# EAGLE design WaterMonitorV6.0 (EAGLE 7.4.0)
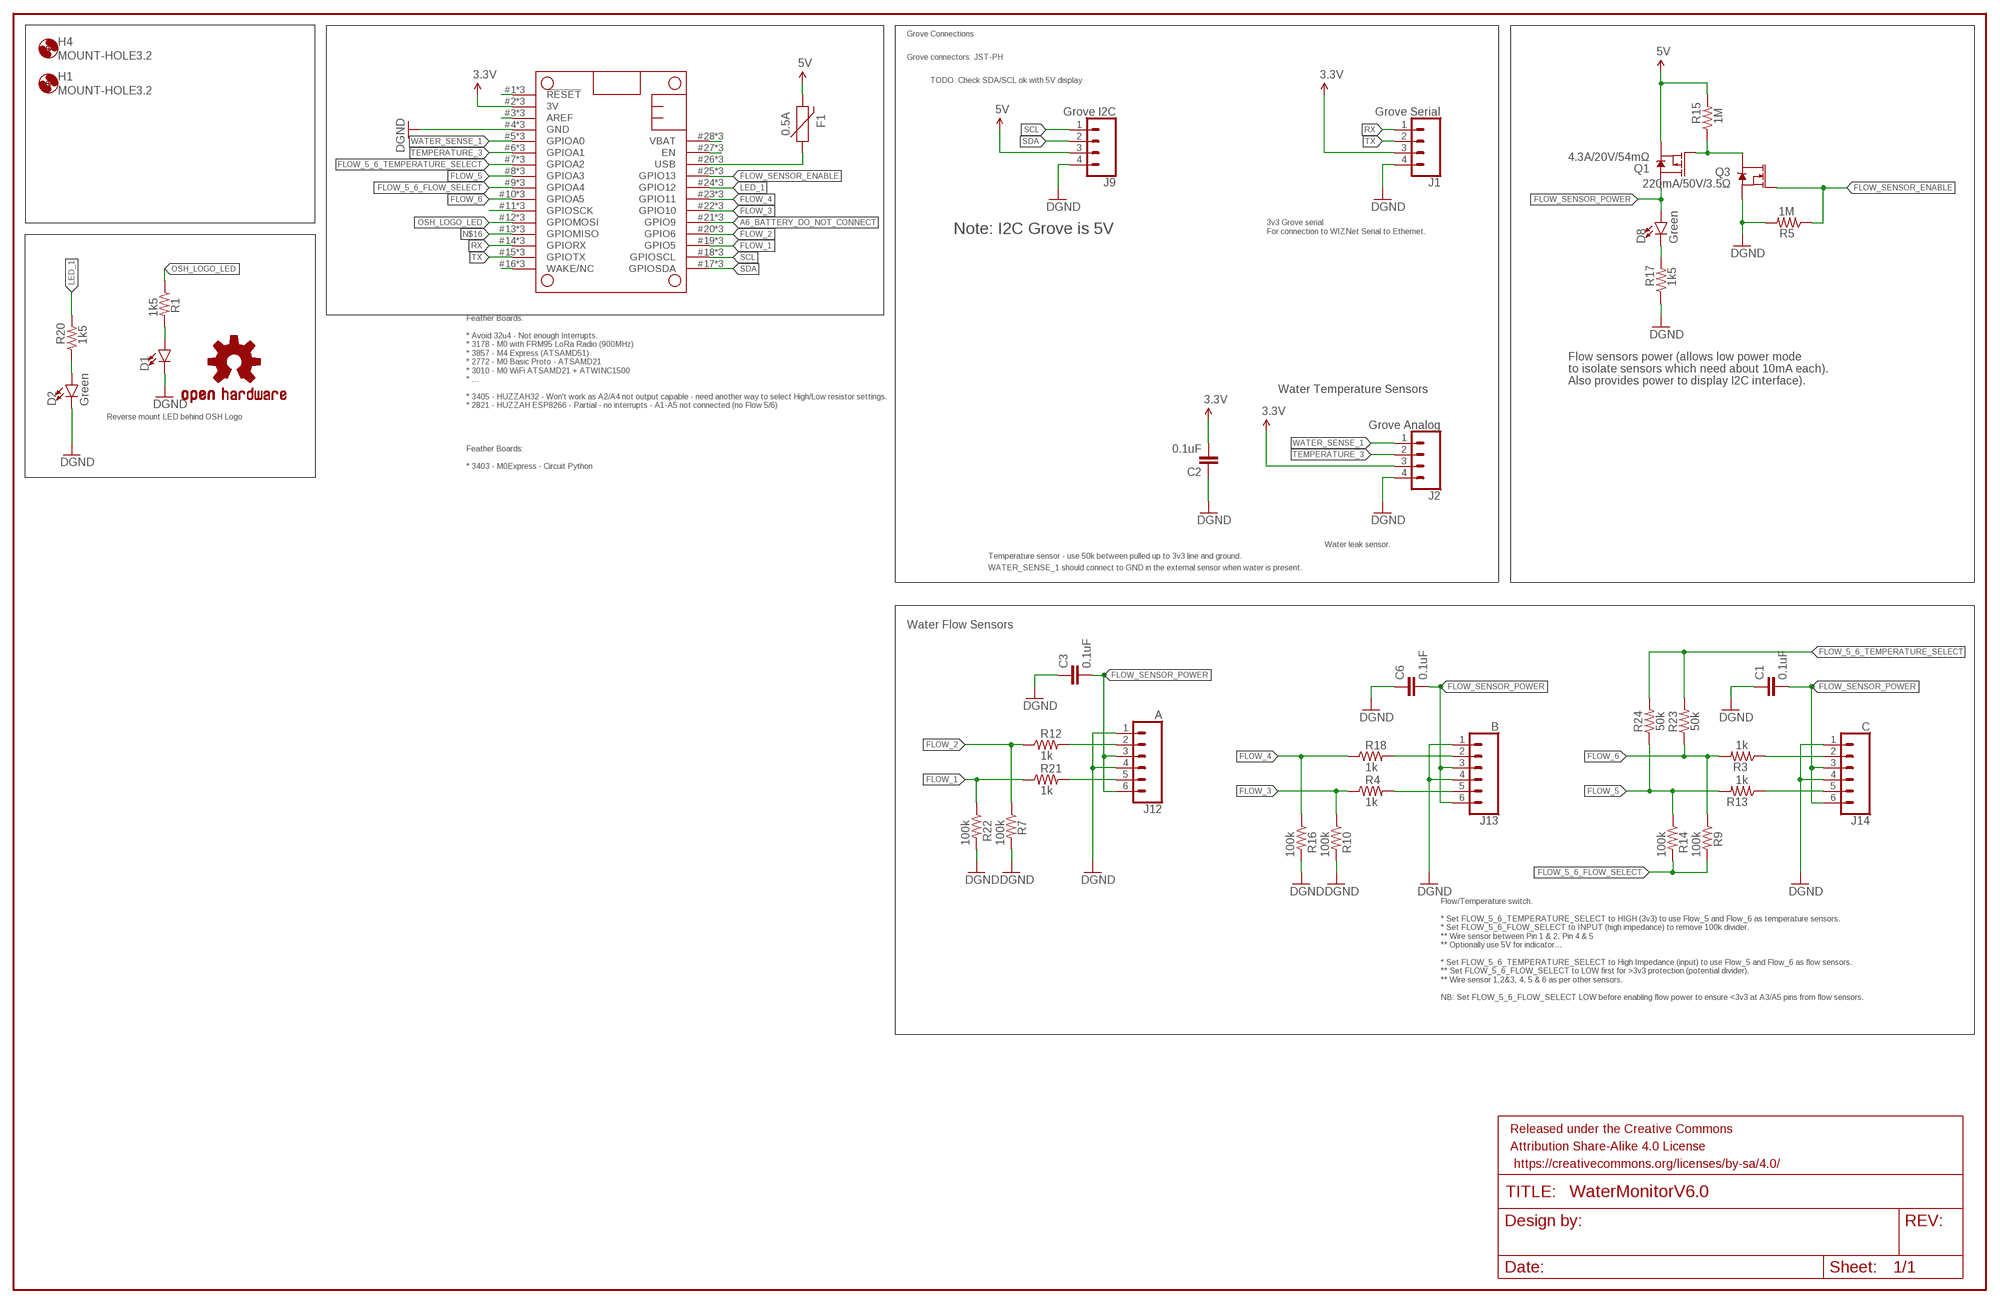
[diagram p0: schematic, sheet 1]

## Parts
C1  0.1uF  CAP0805  [0805]
C2  0.1uF  CAP0805  [0805]
C3  0.1uF  CAP0805  [0805]
C6  0.1uF  CAP0805  [0805]
D1  LED1206-BOTTOM  [LED-1206-BOTTOM]
D2  Green  LED-BLUE1206  [LED-1206]
D8  Green  LED-BLUE1206  [LED-1206]
F1  0.5A  PPTC_HALF-AMP  [1206]
FRAME2  FRAME-LEDGER  [CREATIVE_COMMONS]
H1  MOUNT-HOLE3.2  [3,2]
H4  MOUNT-HOLE3.2  [3,2]
J1  Grove Serial  CONN_04JST-PTH-VERT  [JST-4-PTH-VERT]
J2  Grove Analog  CONN_04JST-PTH-VERT  [JST-4-PTH-VERT]
J9  Grove I2C  CONN_04JST-PTH-VERT  [JST-4-PTH-VERT]
J12  A  RJ11-6  [RJ11-6]
J13  B  RJ11-6  [RJ11-6]
J14  C  RJ11-6  [RJ11-6]
LOGO1  OSHW-LOGOM  [OSHW-LOGO-M]
MS1  FEATHERWINGFEATHEWING_BREAKOUT  [FEATHERWING_BREAKOUT]
Q1  4.3A/20V/54mΩ  MOSFET_PCH-IRLML2244  [SOT23-3]
Q3  220mA/50V/3.5Ω  MOSFET-NCH-BSS138  [SOT23-3]
R1  1k5  RESISTOR0805  [0805]
R3  1k  RESISTOR0805  [0805]
R4  1k  RESISTOR0805  [0805]
R5  1M  RESISTOR0805  [0805]
R7  100k  RESISTOR0805  [0805]
R9  100k  RESISTOR0805  [0805]
R10  100k  RESISTOR0805  [0805]
R12  1k  RESISTOR0805  [0805]
R13  1k  RESISTOR0805  [0805]
R14  100k  RESISTOR0805  [0805]
R15  1M  RESISTOR0805  [0805]
R16  100k  RESISTOR0805  [0805]
R17  1k5  RESISTOR0805  [0805]
R18  1k  RESISTOR0805  [0805]
R20  1k5  RESISTOR0805  [0805]
R21  1k  RESISTOR0805  [0805]
R22  100k  RESISTOR0805  [0805]
R23  50k  RESISTOR0805  [0805]
R24  50k  RESISTOR0805  [0805]

## Nets
3.3V: C2.2 J1.3 J2.3 MS1.2(3V) MS1.#2(3V) MS1.@2(3V)
5V: F1.2 J9.3 Q1.2(S) R15.2
A6_BATTERY_DO_NOT_CONNECT: MS1.21(GPIO9) MS1.#21(GPIO9) MS1.@21(GPIO9)
FLOW_1: MS1.19(GPIO5) MS1.#19(GPIO5) MS1.@19(GPIO5) R21.1 R22.1
FLOW_2: MS1.20(GPIO6) MS1.#20(GPIO6) MS1.@20(GPIO6) R7.1 R12.1
FLOW_3: MS1.22(GPIO10) MS1.#22(GPIO10) MS1.@22(GPIO10) R4.1 R10.1
FLOW_4: MS1.23(GPIO11) MS1.#23(GPIO11) MS1.@23(GPIO11) R16.1 R18.1
FLOW_5: MS1.8(GPIOA3) MS1.#8(GPIOA3) MS1.@8(GPIOA3) R13.2 R14.1 R24.1
FLOW_5_6_FLOW_SELECT: MS1.9(GPIOA4) MS1.#9(GPIOA4) MS1.@9(GPIOA4) R9.2 R14.2
FLOW_5_6_TEMPERATURE_SELECT: MS1.7(GPIOA2) MS1.#7(GPIOA2) MS1.@7(GPIOA2) R23.2 R24.2
FLOW_6: MS1.10(GPIOA5) MS1.#10(GPIOA5) MS1.@10(GPIOA5) R3.2 R9.1 R23.1
FLOW_SENSOR_ENABLE: MS1.25(GPIO13) MS1.#25(GPIO13) MS1.@25(GPIO13) Q3.1(G) R5.1
FLOW_SENSOR_POWER: C1.2 C3.2 C6.2 D8.A J12.3 J12.6 J13.3 J13.6 J14.3 J14.6 Q1.3(D)
GND: C1.1 C2.1 C3.1 C6.1 D1.C D2.C J1.4 J2.4 J9.4 J12.1 J12.4 J13.1 J13.4 J14.1 J14.4 MS1.4(GND) MS1.#4(GND) MS1.@4(GND) Q3.2(S) R5.2 R7.2 R10.2 R16.2 R17.1 R22.2 ; supply symbol labelled DGND
LED_1: MS1.24(GPIO12) MS1.#24(GPIO12) MS1.@24(GPIO12) R20.2
N$1: J12.5 R21.2
N$3: J14.2 R3.1
N$4: J13.5 R4.2
N$6: J14.5 R13.1
N$7: D8.C R17.2
N$11: D2.A R20.1
N$12: J12.2 R12.2
N$13: MS1.1(!RESET) MS1.#1(!RESET) MS1.@1(!RESET)
N$15: MS1.27(EN) MS1.#27(EN) MS1.@27(EN)
N$16: MS1.13(GPIOMISO) MS1.#13(GPIOMISO) MS1.@13(GPIOMISO)
N$19: Q1.1(G) Q3.3(D) R15.1
N$20: MS1.3(AREF) MS1.#3(AREF) MS1.@3(AREF)
N$21: D1.A R1.2
N$22: J13.2 R18.2
N$25: MS1.11(GPIOSCK) MS1.#11(GPIOSCK) MS1.@11(GPIOSCK)
N$47: MS1.16(WAKE/NC) MS1.#16(WAKE/NC) MS1.@16(WAKE/NC)
OSH_LOGO_LED: MS1.12(GPIOMOSI) MS1.#12(GPIOMOSI) MS1.@12(GPIOMOSI) R1.1
RX: J1.1 MS1.14(GPIORX) MS1.#14(GPIORX) MS1.@14(GPIORX)
SCL: J9.1 MS1.18(GPIOSCL) MS1.#18(GPIOSCL) MS1.@!8(GPIOSCL)
SDA: J9.2 MS1.17(GPIOSDA) MS1.#17(GPIOSDA) MS1.@17(GPIOSDA)
TEMPERATURE_3: J2.2 MS1.6(GPIOA1) MS1.#6(GPIOA1) MS1.@6(GPIOA1)
TX: J1.2 MS1.15(GPIOTX) MS1.#15(GPIOTX) MS1.@15(GPIOTX)
USB: F1.1 MS1.26(USB) MS1.#26(USB) MS1.@26(USB)
VBAT: MS1.28(VBAT) MS1.#28(VBAT) MS1.@28(VBAT)
WATER_SENSE_1: J2.1 MS1.5(GPIOA0) MS1.#5(GPIOA0) MS1.@5(GPIOA0)

## Notes on the sheet
- Grove Connections
- Grove connectors: JST-PH
- TODO: Check SDA/SCL ok with 5V display
- Note: I2C Grove is 5V
- 3v3 Grove serial 
  For connection to WIZNet Serial to Ethernet.
- Water Temperature Sensors
- Flow sensors power (allows low power mode 
  to isolate sensors which need about 10mA each).
  Also provides power to display I2C interface).
- Feather Boards:
  
  * Avoid 32u4 - Not enough Interrupts.
  * 3178 - M0 with FRM95 LoRa Radio (900MHz)
  * 3857 - M4 Express (ATSAMD51)
  * 2772 - M0 Basic Proto - ATSAMD21
  * 3010 - M0 WiFi ATSAMD21 + ATWINC1500
  * ...
  
  * 3405 - HUZZAH32 - Won't work as A2/A4 not output capable - need another way to select High/Low resistor settings.
  * 2821 - HUZZAH ESP8266 - Partial - no interrupts - A1-A5 not connected (no Flow 5/6)
- Reverse mount LED behind OSH Logo
- Feather Boards:
  
  * 3403 - M0Express - Circuit Python
- Water leak sensor.
- Temperature sensor - use 50k between pulled up to 3v3 line and ground.
- WATER_SENSE_1 should connect to GND in the external sensor when water is present.
- Water Flow Sensors
- Flow/Temperature switch.
  
  * Set FLOW_5_6_TEMPERATURE_SELECT to HIGH (3v3) to use Flow_5 and Flow_6 as temperature sensors.
  * Set FLOW_5_6_FLOW_SELECT to INPUT (high impedance) to remove 100k divider.
  ** Wire sensor between Pin 1 & 2, Pin 4 & 5
  ** Optionally use 5V for indicator...
  
  * Set FLOW_5_6_TEMPERATURE_SELECT to High Impedance (input) to use Flow_5 and Flow_6 as flow sensors.
  ** Set FLOW_5_6_FLOW_SELECT to LOW first for >3v3 protection (potential divider).
  ** Wire sensor 1,2&3, 4, 5 & 6 as per other sensors.
  
  NB: Set FLOW_5_6_FLOW_SELECT LOW before enabling flow power to ensure <3v3 at A3/A5 pins from flow sensors.

## Library data of the parts
C1-C3 C6 = SparkFun-Passives:CAP: Capacitor Standard 0603 ceramic capacitor, and 0.1" leaded capacitor.
D1 = SparkFun-LED:LED: LED (Generic) Standard schematic elements and footprints for 5mm, 3mm, 1206, and 0603 sized LEDs. Generic LEDs with no color specified.
D2 D8 = SparkFun-LED:LED-BLUE: Blue SMD LED Used in manufacturing of various products at SparkFun Packages: 0603 - SMD 0603 package [Product Link] <http://www.digikey.com/product-detail/en/SMLE12BC7TT86/511-1589-2-ND/1641808> 1206 - SMD1206 package [Product Link] <http://www.digikey.com/product-detail/en/lite-on-inc/LTST-C150TBKT/160-1643-1-ND/573584> SparkFun Products: ESP8266 Thing-Dev Board <https://www.sparkfun.com/products/13711> RedBoard <https://www.sparkfun.com/products/12757>; PROD_ID: DIO-09911; VALUE: BLUE
F1 = SparkFun-Fuses:PPTC: Resettable Fuse PPTC Resettable Fuse. Really a sort of resistor with a polymeric positive temperature coefficient whose resistance increases dramatically with an increase in temperature. When heated by the power passing through the resistance rises causing the current to be limited, protecting the circuit. This is achieved by the transition of the polymer from a crystalline to an amorphous state where the conductive carbon separates breaking the conductive pathways found in the cool crystalline structure. When a PPTC cools back down it resumes conducting letting the circuit turn back on. SparkFun Products: SparkFun RedBoard - Programmed with Arduino <https://www.sparkfun.com/products/12757> Pro Micro - 5V/16MHz <https://www.sparkfun.com/products/12640> Arduino Pro 328 - 5V/16MHz <https://www.sparkfun.com/products/10915> MP3 Trigger <https://www.sparkfun.com/products/13720>; PROD_ID: RES-08585; VALUE: 6V/0.5A
FRAME2 = SparkFun-Aesthetics:FRAME-LEDGER: Schematic Frame Standard 11x14 US Ledger frame
H1 H4 = holes:MOUNT-HOLE: MOUNTING HOLE with drill center marker
J1 J2 J9 = SparkFun-Connectors:CONN_04: Multi connection point. Often used as Generic Header-pin footprint for 0.1 inch spaced/style header connections On any of the 0.1 inch spaced packages, you can populate with these: Break Away Headers - Straight <https://www.sparkfun.com/products/116> (PRT-00116) Break Away Male Headers - Right Angle <https://www.sparkfun.com/products/553> (PRT-00553) Female Headers <https://www.sparkfun.com/products/115> (PRT-00115) Break Away Headers - Machine Pin <https://www.sparkfun.com/products/117> (PRT-00117) Break Away Female Headers - Swiss Machine Pin <https://www.sparkfun.com/products/743> (PRT-00743) For SCREWTERMINALS and SPRING TERMINALS visit here: Screw Terimnals on SparkFun.com <https://www.sparkfun.com/search/results?term=Screw+Terminals> (5mm/3.5mm/2.54mm spacing) This device is also useful as a general connection point to wire up your design to another part of your project. Our various solder wires solder well into these plated through hole pads. Hook-Up Wire - Assortment (Stranded, 22 AWG) <https://www.sparkfun.com/products/11375> (PRT-11375) Hook-Up Wire - Assortment (Solid Core, 22 AWG) <https://www.sparkfun.com/products/11367> (PRT-11367) View the entire wire category on our website here <https://www.sparkfun.com/categories/141> Special notes: Molex polarized connector foot print use with SKU : PRT-08231 with associated crimp pins and housings. 1MM SMD Version SKU: PRT-10208; PROD_ID: CONN-13251
J12-J14 = SparkFun-Connectors:RJ11-6: RJ11 Jack - 6 pin Commonly found on CAT3 devices and some Microchip programmers. Here is the connector we sell at SparkFun: RJ11 6-Pin Connector <https://www.sparkfun.com/products/132> (PRT-00132) Datasheet <http://www.sparkfun.com/datasheets/Prototyping/Connectors/RJ11-Datasheet.pdf> It is used on this SparkFun product: SparkFun Weather Shield <https://www.sparkfun.com/products/12081> (DEV-12081) Weather Meters <https://www.sparkfun.com/products/8942> (SEN-08942); PROD_ID: CONN-08590; SF_ID: PRT-00132; VALUE: RJ11
LOGO1 = SparkFun-Aesthetics:OSHW-LOGO: Open Source Hardware Logo This logo indicates the piece of hardware it is found on incorporates a OSHW license and/or adheres to the definition of open source hardware found here: http://freedomdefined.org/OSHW
MS1 = ThingySticks:FEATHERWING
Q1 = SparkFun-DiscreteSemi:MOSFET_PCH: P-channel MOSFETs Voltage controlled devices that allow control of high current outputs. SparkFun Products: SparkFun ESP32 Thing <https://www.sparkfun.com/products/13907> SparkFun ESP8266 Thing <https://www.sparkfun.com/products/13231>; PROD_ID: TRANS-11153
Q3 = SparkFun-DiscreteSemi:MOSFET-NCH: N-channel MOSFETs Voltage controlled devices that allow control of high current outputs. SparkFun Products: SparkFun OpenScale <https://www.sparkfun.com/products/13261> SparkFun Digital Sandbox <https://www.sparkfun.com/products/12651> SparkFun Monster Moto Shield <https://www.sparkfun.com/products/10182> SparkFun MOSFET Power Controller <https://www.sparkfun.com/products/11214>; PROD_ID: TRANS-00830
R1 R3-R5 R7 R9 R10 R12-R18 R20-R24 = SparkFun-Resistors:RESISTOR: Generic Resistor Package

## Board
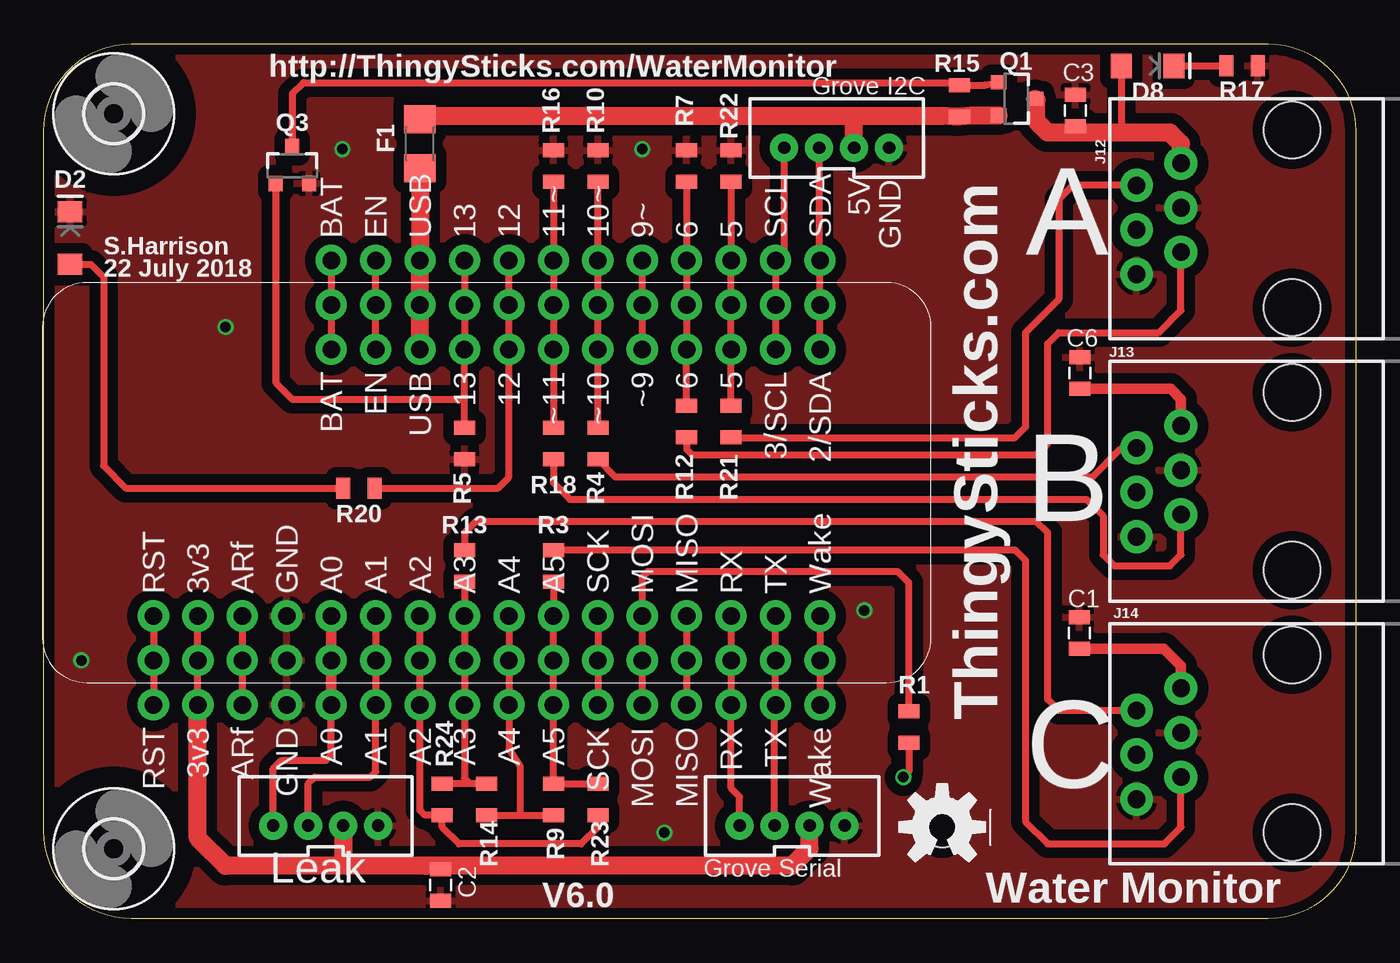
[diagram p1: board, top side]
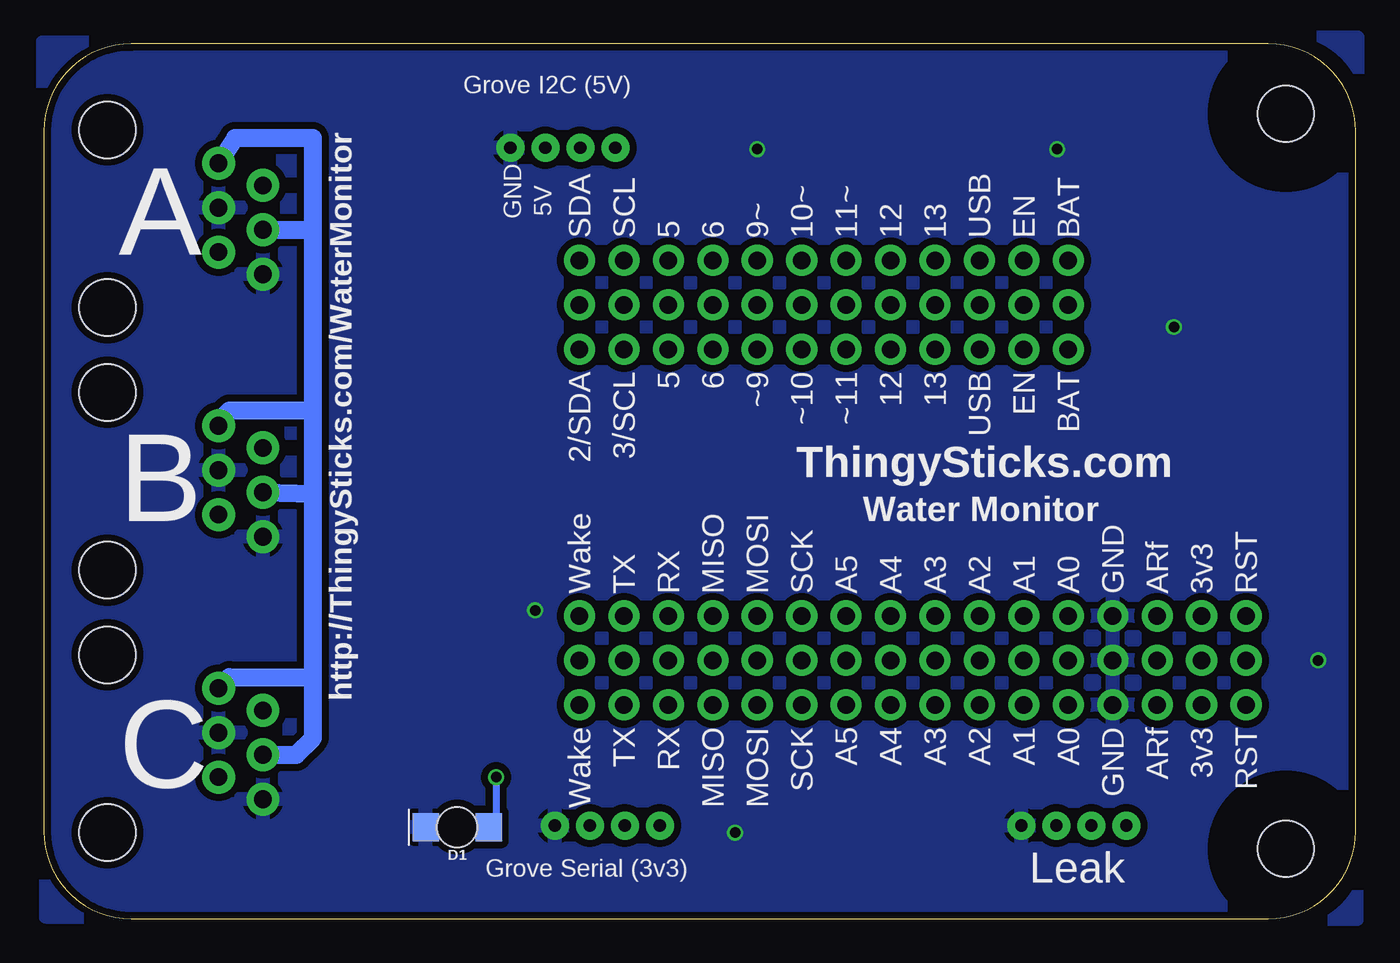
[diagram p2: board, bottom side, seen from below]

Size 75 x 50 mm. Coordinates in mm from the lower left corner, seen from the top.
Outline: 5,50 70,50 arc-90 75,45 75,5 arc-90 70,0 5,0 arc-90 0,5 0,45 arc-90 5,50
Copper layers (1*16): Top 0.035mm / dielectric 1.5mm / Bottom 0.035mm
Design rules "dirt_cheap_dirty_boards.v1": minimum track width 5mil, minimum drill 12mil, track to track 5mil, track to pad 5mil, pad to pad 5mil, via to via 5mil, smd to smd 0mil, copper to edge 10mil, drill to drill 10mil, minimum pad ring 10mil, minimum via ring 6mil, stop-mask expansion 2mil, vias tented up to drill 25mil, thermal gap 10mil

### Footprints (pad centres in the part's own frame; a part is rotated, then mirrored left to right if it is on the bottom)
0805 = smd 0.8 x 1.2: 1 -0.9,0; 2 0.9,0
LED-1206-BOTTOM = smd 1.5 x 1.6: A -1.8,0; C 1.8,0 | hole 2.3: 0,0
LED-1206 = smd 1.2 x 1.4: A -1.5,0; C 1.5,0
1206 = smd 1.6 x 1.8: 1 -1.4,0; 2 1.4,0
3,2 = hole 3.2: 0,0
JST-4-PTH-VERT = drill 0.7 pad 1.6: 1 -3,-0.55; 2 -1,-0.55; 3 1,-0.55; 4 3,-0.55
RJ11-6 = drill 1.016 pad 1.88: 1 -3.175,8.89; 2 -1.905,6.35; 3 -0.635,8.89; 4 0.635,6.35; 5 1.905,8.89; 6 3.175,6.35 | hole 3.251: -5.08,0; 5.08,0
FEATHERWING_BREAKOUT = drill 1 pad 1.778: 1 6.35,1.27; 2 8.89,1.27; 3 11.43,1.27; 4 13.97,1.27; 5 16.51,1.27; 6 19.05,1.27; 7 21.59,1.27; 8 24.13,1.27; 9 26.67,1.27; 10 29.21,1.27; 11 31.75,1.27; 12 34.29,1.27; 13 36.83,1.27; 14 39.37,1.27; 15 41.91,1.27; 16 44.45,1.27; 17 44.45,21.59; 18 41.91,21.59; 19 39.37,21.59; 20 36.83,21.59; 21 34.29,21.59; 22 31.75,21.59; 23 29.21,21.59; 24 26.67,21.59; 25 24.13,21.59; 26 21.59,21.59; 27 19.05,21.59; 28 16.51,21.59; #1 6.35,3.81; #2 8.89,3.81; #3 11.43,3.81; #4 13.97,3.81; #5 16.51,3.81; #6 19.05,3.81; #7 21.59,3.81; #8 24.13,3.81; #9 26.67,3.81; #10 29.21,3.81; #11 31.75,3.81; #12 34.29,3.81; #13 36.83,3.81; #14 39.37,3.81; #15 41.91,3.81; #16 44.45,3.81; #17 44.45,19.05; #18 41.91,19.05; #19 39.37,19.05; #20 36.83,19.05; #21 34.29,19.05; #22 31.75,19.05; #23 29.21,19.05; #24 26.67,19.05; #25 24.13,19.05; #26 21.59,19.05; #27 19.05,19.05; #28 16.51,19.05; @1 6.35,-1.27; @2 8.89,-1.27; @3 11.43,-1.27; @4 13.97,-1.27; @5 16.51,-1.27; @6 19.05,-1.27; @7 21.59,-1.27; @8 24.13,-1.27; @9 26.67,-1.27; @10 29.21,-1.27; @11 31.75,-1.27; @12 34.29,-1.27; @13 36.83,-1.27; @14 39.37,-1.27; @15 41.91,-1.27; @16 44.45,-1.27; @17 44.45,24.13; @19 39.37,24.13; @20 36.83,24.13; @21 34.29,24.13; @22 31.75,24.13; @23 29.21,24.13; @24 26.67,24.13; @25 24.13,24.13; @26 21.59,24.13; @27 19.05,24.13; @28 16.51,24.13; @!8 41.91,24.13
SOT23-3 = smd 0.8 x 0.9: 1 -0.95,-1; 2 0.95,-1; 3 0,1.1

### Placement (x,y rotation side)
C1  59.19,16.33 270 top
C2  22.69,1.94 90 top
C3  58.98,46.2 270 top
C6  59.23,31.18 270 top
D1  51.36,5.24 180 bottom
D2  1.51,38.89 90 top
D8  63.11,48.73 0 top
F1  21.51,44.29 90 top
FRAME2  16.75,-12.23 0 top  (outside the outline)
H1  4,46 0 top
H4  4,4 0 top
J1  42.78,5.87 0 top
J2  16.11,5.87 0 top
J9  45.33,44.61 0 top
J12  71.36,40 90 top
J13  71.36,25 90 top
J14  71.36,10 90 top
LOGO1  51.36,5.24 0 top
MS1  -0.08,13.49 0 top
Q1  55.58,46.85 270 top
Q3  14.21,43.02 0 top
R1  49.45,10.95 270 top
R3  29.13,20.16 270 top
R4  31.67,27.14 270 top
R5  24.05,27.14 270 top
R7  36.75,43.02 90 top
R9  29.13,6.83 270 top
R10  31.67,43.02 90 top
R12  36.75,28.41 270 top
R13  24.05,20.16 270 top
R14  25.32,6.83 270 top
R15  52.33,46.73 270 top
R16  29.13,43.02 90 top
R17  68.5,48.73 180 top
R18  29.13,27.14 270 top
R20  18.02,24.61 0 top
R21  39.29,28.41 270 top
R22  39.29,43.02 90 top
R23  31.67,6.83 270 top
R24  22.78,6.83 270 top

### Tracks (layer width: path | path; a pad name or v marks a point on that pad's centre or on a via)
3.3V
  Top 0.406: MS1.@2 MS1.2 MS1.#2 | C2.2 22.01,2.84 21.83,3.01
  Top 1.016: MS1.@2 8.81,4.6 10.4,3.01 17.38,3.01 | 17.38,3.01 21.83,3.01 42.78,3.01 43.78,4.01 J1.3 | J2.3 17.12,3.29 17.38,3.01
5V
  Top 1.016: F1.2 21.51,45.56 22.15,45.88 46.59,45.88 | 46.59,45.88 51.36,45.88 52.04,45.83 R15.2 53.03,45.9 Q1.2 | J9.3 46.33,45.61 46.59,45.88
A6_BATTERY_DO_NOT_CONNECT
  Top 0.406: MS1.@21 MS1.21 MS1.#21
FLOW_1
  Top 0.406: R22.1 MS1.@19 MS1.19 MS1.#19 R21.1
FLOW_2
  Top 0.406: R7.1 MS1.@20 MS1.20 MS1.#20 R12.1
FLOW_3
  Top 0.406: R4.1 MS1.#22 MS1.22 MS1.@22 R10.1
FLOW_4
  Top 0.406: R16.1 29.13,38.26 28.81,37.94 MS1.@23 MS1.23 MS1.#23 R18.1
FLOW_5
  Top 0.406: R14.1 24.37,7.72 | 24.37,7.72 R24.1 | R13.2 MS1.#8 MS1.8 MS1.@8 24.05,8.04 24.37,7.72
FLOW_5_6_FLOW_SELECT
  Top 0.406: R14.2 27.23,5.92 | 27.23,5.92 R9.2 | 27.23,5.92 27.23,8.73 26.59,9.68 MS1.@9 MS1.9 MS1.#9
FLOW_5_6_TEMPERATURE_SELECT
  Top 0.406: R23.2 31.67,5.24 30.72,4.29 23.73,4.29 22.78,5.24 R24.2 21.78,5.92 21.51,6.19 MS1.@7 MS1.7 MS1.#7
FLOW_6
  Top 0.406: R23.1 R9.1 MS1.@10 MS1.10 MS1.#10 R3.2
FLOW_SENSOR_ENABLE
  Top 0.406: MS1.@25 MS1.25 MS1.#25 24.05,29.68 | R5.1 24.05,29.68 | Q3.1 13.26,30.64 14.21,29.68 24.05,29.68
FLOW_SENSOR_POWER
  Top 0.406: C3.2 58.98,45.24 59.93,44.92 | D8.A 61.61,45.16 61.83,44.92
  Top 0.61: J14.6 65.01,14.45 64.03,15.43 C1.2 | C6.2 64.42,30.27 65.01,29.68 J13.6
  Top 1.016: J12.6 65.01,44.29 64.38,44.92 61.83,44.92 59.93,44.92 57.39,44.92 56.75,45.56 56.75,46.78 Q1.3
  Bottom 1.016: J13.3 59.61,24.29 | 59.61,24.29 59.61,29.05 | 59.61,29.05 59.61,39.21 | 59.61,39.21 59.61,44.61 64.06,44.61 J12.6 | J13.6 65.01,28.41 64.38,29.05 59.61,29.05 | J14.3 60.56,9.37 59.61,10.32 59.61,13.81 | 59.61,13.81 59.61,24.29 | J14.6 64.38,13.81 59.61,13.81 | J12.3 59.77,39.36 59.61,39.21
GND  (via drill 0.6)
  other vias: 2.14,14.76 10.4,33.81 34.21,43.97 46.91,17.62 17.07,43.97 35.48,4.92
  pour Bottom (isolate 0.406, rank 6): -0.11,50.37 75.07,50.07 74.89,0.12 8.57,-0.08 -0.06,0
  pour Top (isolate 0.61, rank 6): -0.1,50.41 75.05,50.08 74.83,-0.13 0.01,-0.41
LED_1
  Top 0.406: R20.2 25.96,24.61 26.59,25.24 MS1.#24 MS1.24 MS1.@24
N$1
  Top 0.406: R21.2 39.34,27.46 55.48,27.46 56.12,28.1 56.12,33.5 58.03,35.4 58.03,41.11 58.81,41.91 J12.5
N$3
  Top 0.406: R3.1 55.54,21.06 56.12,20.48 56.12,5.55 57.39,4.29 64.06,4.29 65.01,5.24 J14.2
N$4
  Top 0.406: J13.5 61.52,26.83 59.93,25.24 32.68,25.24 R4.2
N$6
  Top 0.406: J14.5 58.03,11.9 57.39,12.54 57.39,22.06 56.75,22.7 24.69,22.7 24.05,22.06 R13.1
N$7
  Top 0.406: D8.C R17.2
N$11
  Top 0.406: D2.A 2.69,37.39 3.41,36.67 3.41,25.88 4.68,24.61 R20.1
N$12
  Top 0.406: R12.2 36.75,26.83 37.07,26.51 56.75,26.51 57.39,27.14 57.39,32.86 58.03,33.5 63.74,33.5 65.01,34.77 J12.2
N$13
  Top 0.406: MS1.#1 MS1.1 MS1.@1
N$15
  Top 0.406: MS1.#27 MS1.27 MS1.@27
N$16
  Top 0.406: MS1.#13 MS1.13 MS1.@13
N$19
  Top 0.406: Q3.3 14.21,47.15 14.84,47.78 52.63,47.78 52.14,47.63 R15.1 53.78,47.63 Q1.1
N$20
  Top 0.406: MS1.#3 MS1.3 MS1.@3
N$21  (via drill 0.6)
  Top 0.406: R1.2 49.45,8.41 v49.14,8.1
  Bottom 0.406: v49.14,8.1 49.14,5.66 D1.A
N$22
  Top 0.406: R18.2 29.13,24.92 30.09,23.97 59.61,23.97 60.56,23.02 60.56,20.8 61.2,20.16 64.38,20.16 65.01,20.8 J13.2
N$25
  Top 0.406: MS1.#11 MS1.11 MS1.@11
N$47
  Top 0.406: MS1.#16 MS1.16 MS1.@16
OSH_LOGO_LED
  Top 0.406: 34.27,12.17 MS1.@12 MS1.12 MS1.#12 34.21,19.52 34.53,19.84 48.82,19.84 49.45,19.21 R1.1
RX
  Top 0.406: MS1.#14 MS1.14 MS1.@14 39.29,7.46 39.78,6.97 J1.1
SCL
  Top 0.406: MS1.#18 MS1.18 MS1.@!8 42.33,38.11 J9.1
  Bottom 0.406: 42.33,38.11 MS1.@!8
SDA
  Top 0.406: MS1.#17 MS1.17 MS1.@17 44.33,37.67 J9.2
TEMPERATURE_3
  Top 0.406: MS1.#6 MS1.6 MS1.@6 18.97,8.41 18.66,8.1 15.48,8.1 15.11,7.73 J2.2
TX
  Top 0.406: MS1.#15 MS1.15 MS1.@15 41.78,12.18 J1.2
USB
  Top 1.016: MS1.#26 MS1.26 MS1.@26 F1.1
VBAT
  Top 0.406: MS1.@28 MS1.28 MS1.#28
WATER_SENSE_1
  Top 0.406: J2.1 13.11,8.59 13.57,9.05 16.11,9.05 16.43,9.37 MS1.@5
  Top 0.61: MS1.@5 MS1.5 MS1.#5

### Text on the board
tNames: http://ThingySticks.com/WaterMonitor | Grove I2C | 5V | GND | ThingySticks.com | S.Harrison | A | 22 July 2018 | B | C | Water Monitor | Leak | V6.0 | Grove Serial
bNames: Grove I2C (5V) | http://ThingySticks.com/WaterMonitor | 5V | GND | A | ThingySticks.com | Water Monitor | B | C | Leak | Grove Serial (3v3)